# EAGLE design untitled (EAGLE 7.5.0)
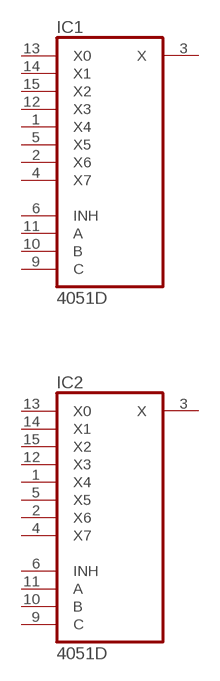
[diagram p0: schematic, sheet 1]

## Parts
IC1  4051D  [SO16]
IC2  4051D  [SO16]
Unconnected: IC1.1(X4) IC1.2(X6) IC1.3(X) IC1.4(X7) IC1.5(X5) IC1.6(INH) IC1.9(C) IC1.10(B) IC1.11(A) IC1.12(X3) IC1.13(X0) IC1.14(X1) IC1.15(X2) IC2.1(X4) IC2.2(X6) IC2.3(X) IC2.4(X7) IC2.5(X5) IC2.6(INH) IC2.9(C) IC2.10(B) IC2.11(A) IC2.12(X3) IC2.13(X0) IC2.14(X1) IC2.15(X2)

## Power pins joined to a net without a drawn wire
GND: IC1.8(GND) IC2.8(GND)
VCC: IC1.16(VCC) IC2.16(VCC)
VEE: IC1.7(VEE) IC2.7(VEE)

## Library data of the parts
IC1 IC2 = 40xx:4051: 8-channel ANALOG MULTIPLEXER

## Board
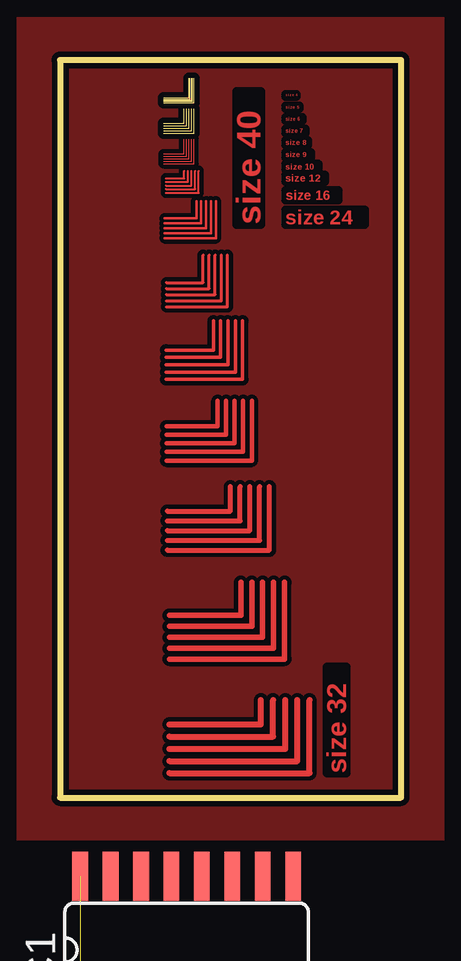
[diagram p1: board, top side]

Size 14.22 x 30.73 mm. Coordinates in mm from the lower left corner, seen from the top.
Outline: 4.32,28.96 5.59,28.96 5.59,29.97
Outline: 4.32,29.01 5.54,29.01 5.54,29.97
Outline: 4.32,29.06 5.49,29.06 5.49,29.97
Outline: 4.32,29.11 5.44,29.11 5.44,29.97
Outline: 4.32,29.16 5.38,29.16 5.38,29.97
Outline: 4.32,27.69 5.59,27.69 5.59,28.7
Outline: 4.32,27.79 5.49,27.79 5.49,28.7
Outline: 4.32,27.89 5.38,27.89 5.38,28.7
Outline: 4.32,27.99 5.28,27.99 5.28,28.7
Outline: 4.32,28.09 5.18,28.09 5.18,28.7
Outline: 14.22,30.73 0,30.73 0,0 14.22,0 14.22,30.73
Copper layers (1*16): Top 0.035mm / dielectric 1.5mm / Bottom 0.035mm
Design rules "default *": minimum track width 10mil, minimum drill 24mil, track to track 7mil, track to pad 8mil, pad to pad 8mil, via to via 8mil, smd to smd 8mil, copper to edge 9mil, drill to drill 8mil, minimum pad ring 10mil, minimum via ring 8mil, stop-mask expansion 4mil, vias tented up to drill 0mil, thermal gap 10mil

### Footprints (pad centres in the part's own frame; a part is rotated, then mirrored left to right if it is on the bottom)
SO16 = smd 0.66 x 2.032: 1 -4.445,-3.073; 2 -3.175,-3.073; 3 -1.905,-3.073; 4 -0.635,-3.073; 5 0.635,-3.073; 6 1.905,-3.073; 7 3.175,-3.073; 8 4.445,-3.073; 9 4.445,3.073; 10 3.175,3.073; 11 1.905,3.073; 12 0.635,3.073; 13 -0.635,3.073; 14 -1.905,3.073; 15 -3.175,3.073; 16 -4.445,3.073

### Placement (x,y rotation side)
IC1  5.28,-6.35 0 top  (outside the outline)
IC2  5.28,-14.99 0 top  (outside the outline)

### Tracks (layer width: path | path; a pad name or v marks a point on that pad's centre or on a via)
GND  (1 unrouted)
S$1
  pour Top: -1.78,32.51 16,32.51 16,-1.78 -1.78,-1.78
S$2
  Top 0.254: 4.57,1.02 10.41,1.02 10.41,4.06
S$3
  Top 0.254: 4.57,1.52 9.91,1.52 9.91,4.06
S$4
  Top 0.254: 4.57,2.03 9.4,2.03 9.4,4.06
S$5
  Top 0.254: 4.57,2.54 8.89,2.54 8.89,4.06
S$6
  Top 0.254: 4.57,3.05 8.38,3.05 8.38,4.06
S$7
  Top 0.229: 4.57,5.77 9.37,5.77 9.37,8.97
S$8
  Top 0.229: 4.57,6.22 8.91,6.22 8.91,8.97
S$9
  Top 0.229: 4.57,6.68 8.46,6.68 8.46,8.97
S$10
  Top 0.229: 4.57,7.14 8,7.14 8,8.97
S$11
  Top 0.229: 4.57,7.59 7.54,7.59 7.54,8.97
S$12
  Top 0.203: 4.47,10.31 8.74,10.31 8.74,12.95
S$13
  Top 0.203: 4.47,10.72 8.33,10.72 8.33,12.95
S$14
  Top 0.203: 4.47,11.12 7.92,11.12 7.92,12.95
S$15
  Top 0.203: 4.47,11.53 7.52,11.53 7.52,12.95
S$16
  Top 0.203: 4.47,11.94 7.11,11.94 7.11,12.95
S$17
  Top 0.178: 4.45,14.05 8,14.05 8,16.53
S$18
  Top 0.178: 4.45,14.4 7.64,14.4 7.64,16.53
S$19
  Top 0.178: 4.45,14.76 7.29,14.76 7.29,16.53
S$20
  Top 0.178: 4.45,15.11 6.93,15.11 6.93,16.53
S$21
  Top 0.178: 4.45,15.47 6.58,15.47 6.58,16.53
S$22
  Top 0.152: 4.42,17.42 7.62,17.42 7.62,19.86
S$23
  Top 0.152: 4.42,17.73 7.32,17.73 7.32,19.86
S$24
  Top 0.152: 4.42,18.03 7.01,18.03 7.01,19.86
S$25
  Top 0.152: 4.42,18.34 6.71,18.34 6.71,19.86
S$26
  Top 0.152: 4.42,18.64 6.4,18.64 6.4,19.86
S$27
  Top 0.127: 4.45,20.45 6.99,20.45 6.99,22.61
S$28
  Top 0.127: 4.45,20.7 6.73,20.7 6.73,22.61
S$29
  Top 0.127: 4.45,20.95 6.48,20.95 6.48,22.61
S$30
  Top 0.127: 4.45,21.21 6.22,21.21 6.22,22.61
S$31
  Top 0.127: 4.45,21.46 5.97,21.46 5.97,22.61
S$32
  Top 0.102: 4.37,23.32 6.5,23.32 6.5,24.84
S$33
  Top 0.102: 4.37,23.52 6.3,23.52 6.3,24.84
S$34
  Top 0.102: 4.37,23.72 6.1,23.72 6.1,24.84
S$35
  Top 0.102: 4.37,23.93 5.89,23.93 5.89,24.84
S$36
  Top 0.102: 4.37,24.13 5.69,24.13 5.69,24.84
S$37
  Top 0.076: 4.42,25.2 5.79,25.2 5.79,26.11
S$38
  Top 0.076: 4.42,25.35 5.64,25.35 5.64,26.11
S$39
  Top 0.076: 4.42,25.5 5.49,25.5 5.49,26.11
S$40
  Top 0.076: 4.42,25.65 5.33,25.65 5.33,26.11
S$41
  Top 0.076: 4.42,25.81 5.18,25.81 5.18,26.11
S$42
  Top 0.051: 4.32,26.42 5.59,26.42 5.59,27.43
S$43
  Top 0.051: 4.32,26.52 5.49,26.52 5.49,27.43
S$44
  Top 0.051: 4.32,26.62 5.38,26.62 5.38,27.43
S$45
  Top 0.051: 4.32,26.72 5.28,26.72 5.28,27.43
S$46
  Top 0.051: 4.32,26.82 5.18,26.82 5.18,27.43
VCC  (1 unrouted)
VEE  (1 unrouted)

### Text on the board
Top: size 4 | size 5 | size 6 | size 7 | size 8 | size 10 | size 9 | size 12 | size 16 | size 40 | size 24 | size 32
descripion: 1-1mil | 1-2mil | 2mil | 3mil | 4mil | 5mil | size 4 | size 5 | size 6 | size 7 | size 8 | size 9 | 6mil | size 10 | size 12 | size 16 | size 24 | 7mil | 8mil | size 32 | size40 | 9mil | 10mil